# EAGLE design PET_snes_gamepad (EAGLE 9.6.0)
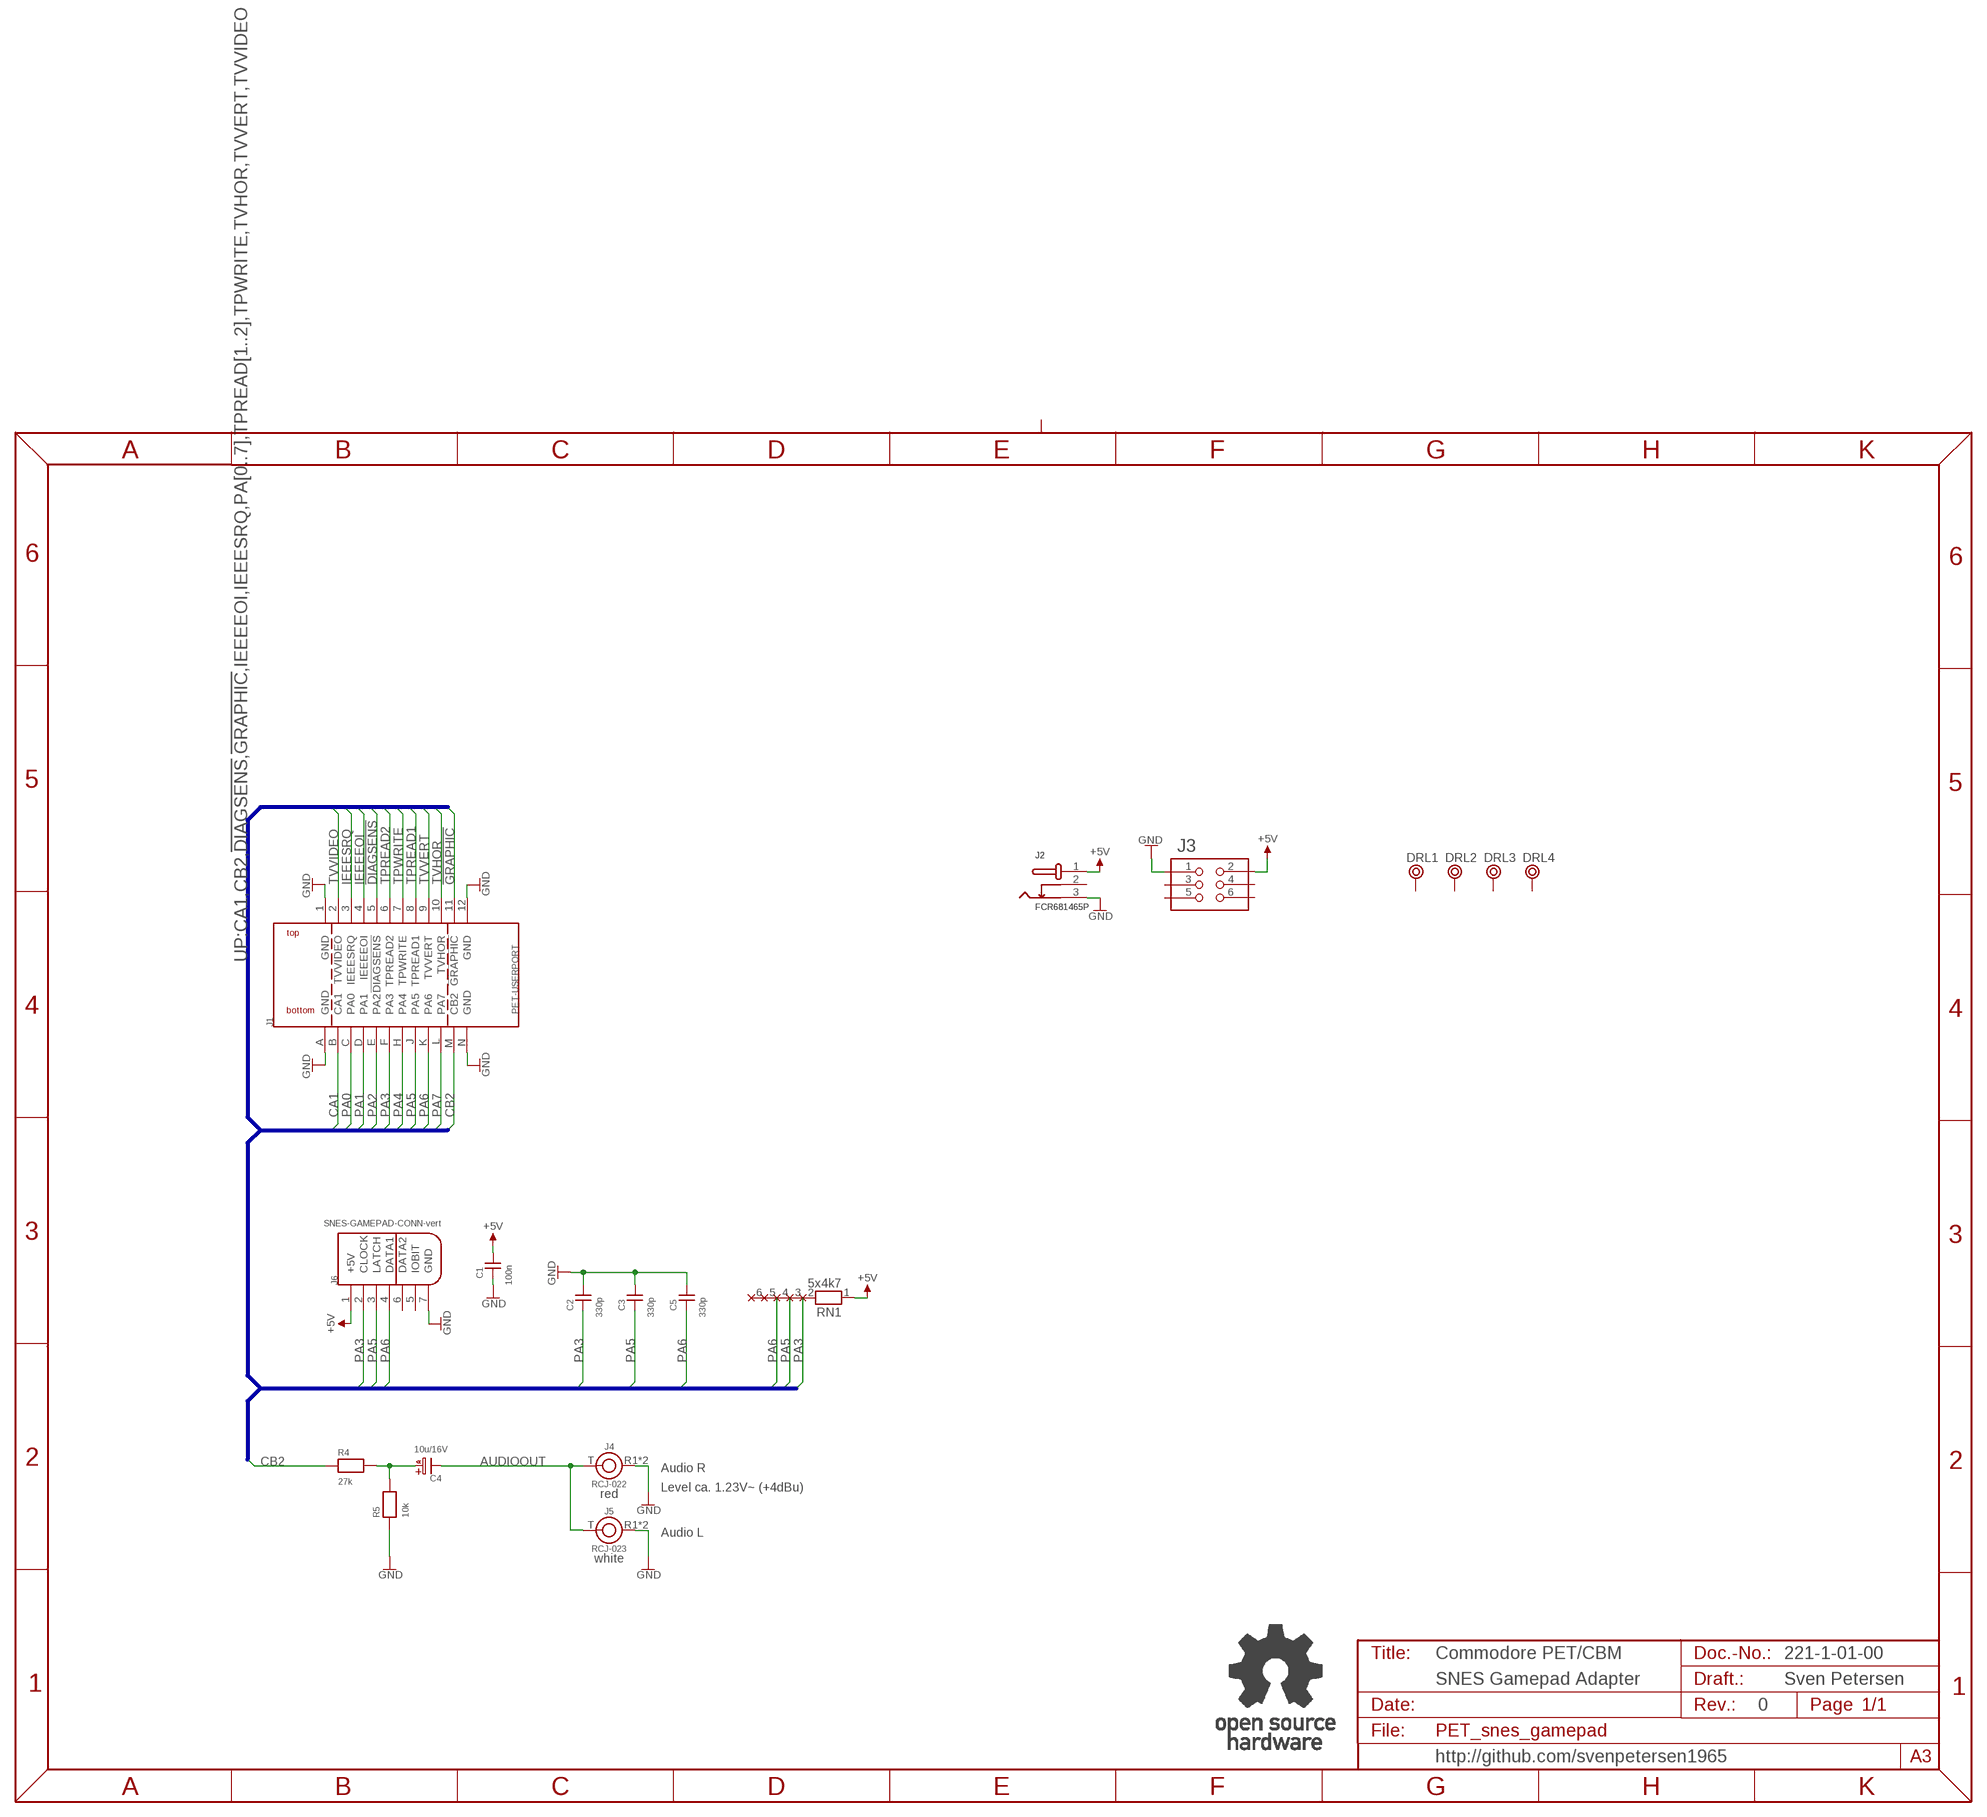
[diagram p0: schematic, sheet 1]

## Parts
C1  100n  CAP01  [C-2,5]
C2  330p  CAP01  [C-2,5]
C3  330p  CAP01  [C-2,5]
C4  10u/16V  C05,0/2,0  [C5,0/2,0]
C5  330p  CAP01  [C-2,5]
DRL1  BOHR3,5  [BOHR3,5]
DRL2  BOHR3,5  [BOHR3,5]
DRL3  BOHR3,5  [BOHR3,5]
DRL4  BOHR3,5  [BOHR3,5]
J1  PET-USERPORT  [USERPORT]
J2  FCR681465P  [FCR681465P]
J3  2X03WV  [2X03WV]
J4  RCJ-022  RCJ-02X  [RCJ-02X]
J5  RCJ-023  RCJ-02X  [RCJ-02X]
J6  SNES-GAMEPAD-CONN-vert  GAMEPAD-CONN_SNESCONN  [SNES_GAMEPAD_VERT]
R4  27k  RES04  [R-10]
R5  10k  RES04  [R-10]
RN1  5x4k7  RN05  [RN-6]
U$2  OPEN_SOURCE_HW  [OPENHW]

## Nets
!DIAGSENS: J1.5(!DIAGSENS)
!GRAPHIC: J1.11(!GRAPHIC)
+5V: C1.2 J2.1 J3.2 J6.1(+5V) RN1.1
AUDIOOUT: C4.K(-) J4.T J5.T
CA1: J1.B(CA1)
CB2: J1.M(CB2) R4.1
GND: C1.1 C2.2 C3.2 C5.2 J1.1(GND) J1.12(GND) J1.A(GND) J1.N(GND) J2.3 J3.1 J4.R1(R) J4.R2(R) J5.R1(R) J5.R2(R) J6.7(GND) R5.1
IEEEEOI: J1.4(IEEEEOI)
IEEESRQ: J1.3(IEEESRQ)
N$1: C4.A(+) R4.2 R5.2
PA0: J1.C(PA0)
PA1: J1.D(PA1)
PA2: J1.E(PA2)
PA3: C2.1 J1.F(PA3) J6.2(CLOCK) RN1.2
PA4: J1.H(PA4)
PA5: C3.1 J1.J(PA5) J6.3(LATCH) RN1.3
PA6: C5.1 J1.K(PA6) J6.4(DATA1) RN1.4
PA7: J1.L(PA7)
TPREAD1: J1.8(TPREAD1)
TPREAD2: J1.6(TPREAD2)
TPWRITE: J1.7(TPWRITE)
TVHOR: J1.10(TVHOR)
TVVERT: J1.9(TVVERT)
TVVIDEO: J1.2(TVVIDEO)
Unconnected: DRL1.P$1 DRL2.P$1 DRL3.P$1 DRL4.P$1 J2.2 J3.3 J3.4 J3.5 J3.6 J6.5(IOBIT) J6.6(DATA2) RN1.5 RN1.6

## Buses
UP:CA1,CB2,!DIAGSENS,!GRAPHIC,IEEEEOI,IEEESRQ,PA[0..7],TPREAD[1..2],TPWRITE,TVHOR,TVVERT,TVVIDEO

## Notes on the sheet
- Audio R
- Level ca. 1.23V~ (+4dBu)
- red
- Audio L
- white
- Commodore PET/CBM | 221-1-01-00
- SNES Gamepad Adapter | Sven Petersen
- 0
- http://github.com/svenpetersen1965

## Library data of the parts
C1-C3 C5 = DISCRETE:CAP01
C4 = ELCO:C05,0/2,0
DRL1-DRL4 = Mech_Bohr:BOHR3,5
J1 = Commodore:PET-USERPORT
J2 = Cliff:FCR681465P
J3 = PINHEAD:2X03WV
J4 J5 = CUI_INC:RCJ-02X
J6 = snes_gamepad:GAMEPAD-CONN_SNESCONN
R4 R5 = DISCRETE:RES04
RN1 = DISCRETE:RN05
U$2 = Logo:OPEN_SOURCE_HW

## Board
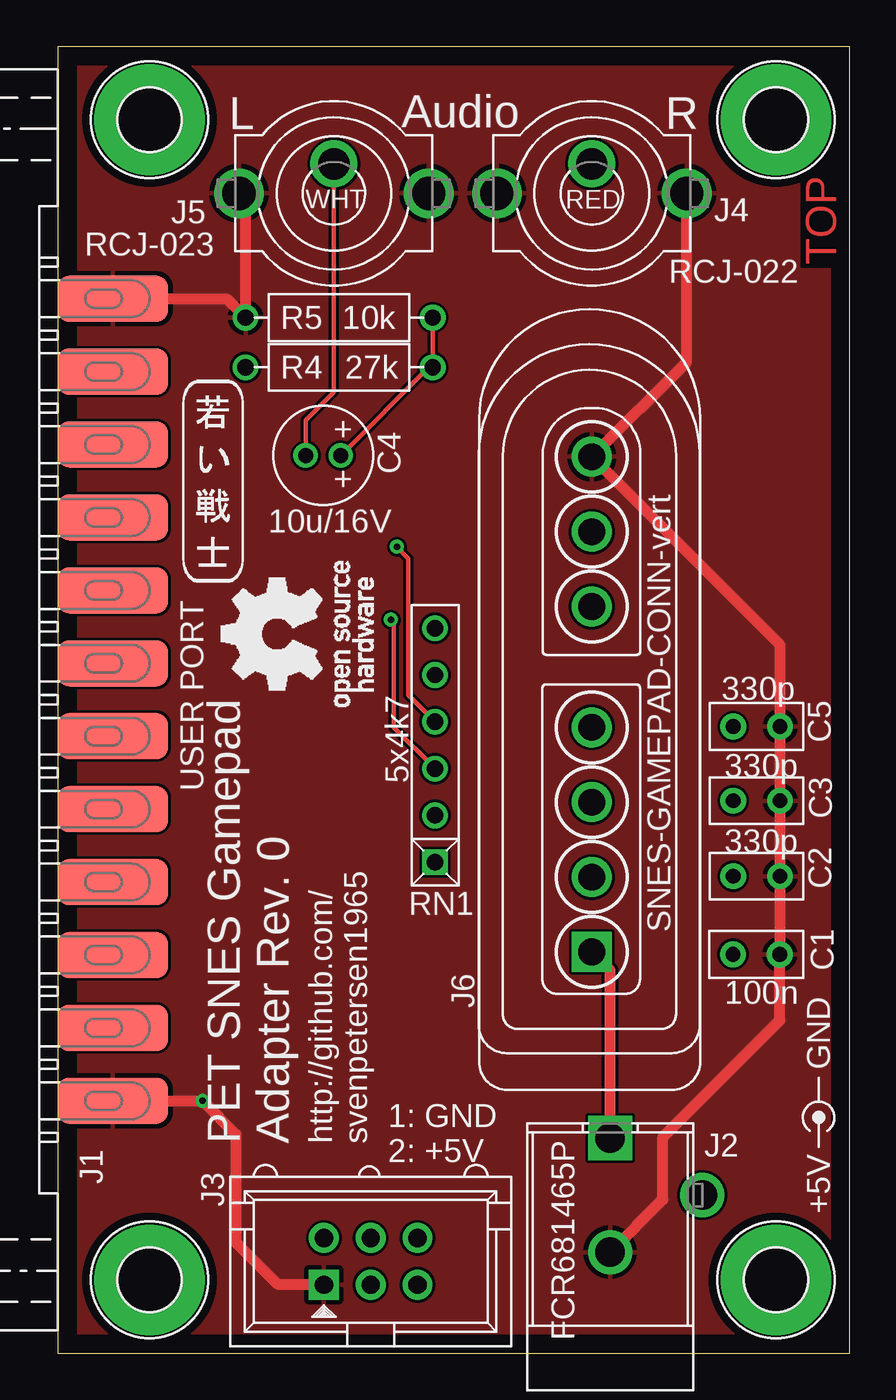
[diagram p1: board, top side]
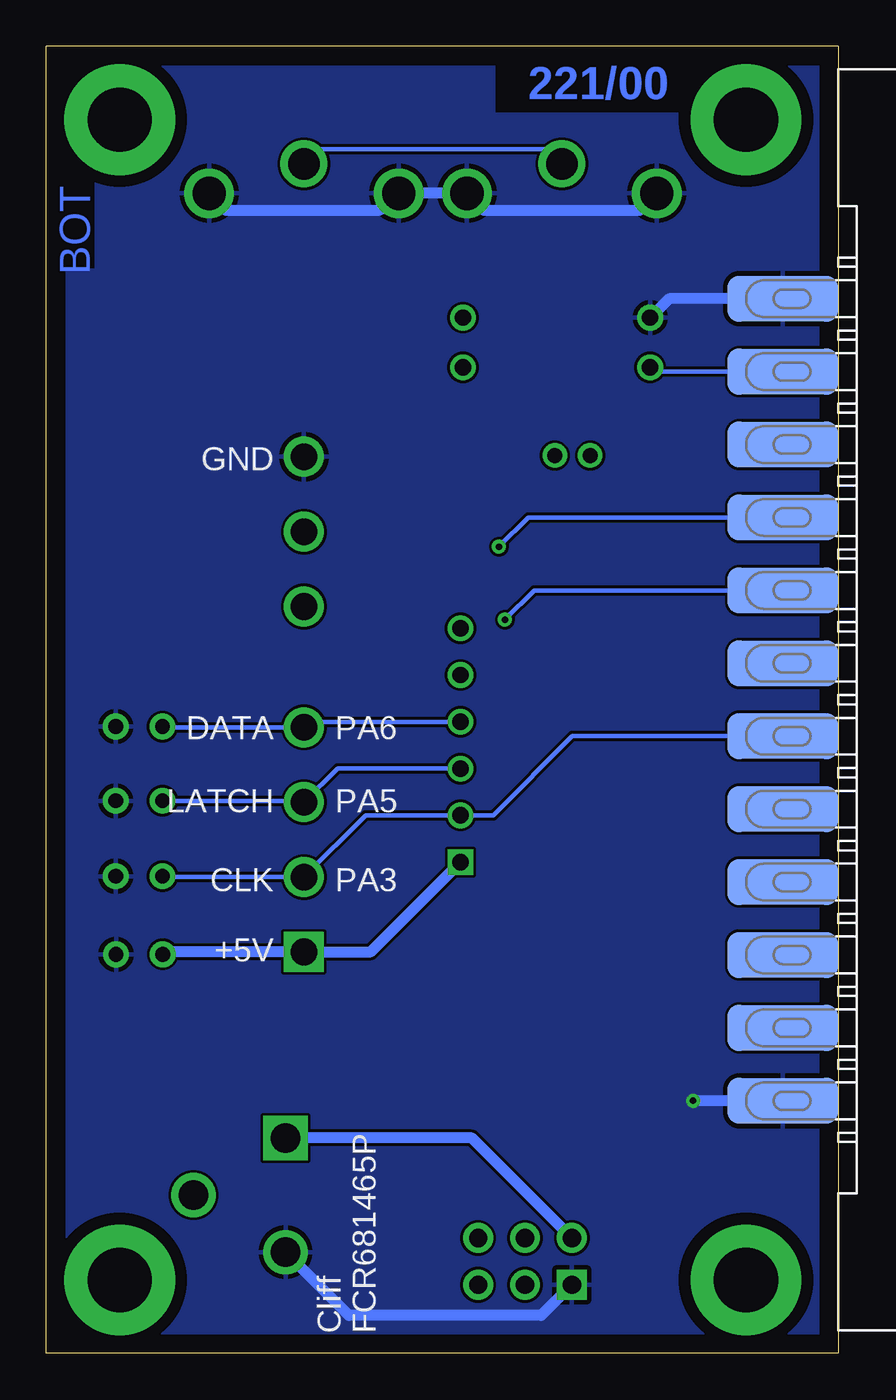
[diagram p2: board, bottom side, seen from below]

Size 43 x 71 mm. Coordinates in mm from the lower left corner, seen from the top.
Outline: 0,0 43,0 43,71 0,71 0,0
Copper layers (1*16): Top 0.035mm / dielectric 1.5mm / Bottom 0.035mm
Design rules "default *": minimum track width 6mil, minimum drill 0.35mm, track to track 6mil, track to pad 6mil, pad to pad 6mil, via to via 6mil, smd to smd 6mil, copper to edge 40mil, drill to drill 6mil, minimum pad ring 10mil, minimum via ring 8mil, stop-mask expansion 4mil, vias tented up to drill 25mil, thermal gap 10mil
bRestrict: 2 lines

### Footprints (pad centres in the part's own frame; a part is rotated, then mirrored left to right if it is on the bottom)
C-2,5 = drill 0.8 pad 1.397: 1 -1.27,0; 2 1.27,0
C5,0/2,0 = drill 0.813 pad 1.27: A -0.953,0; K 0.953,0
BOHR3,5 = drill 3.5 pad 6: P$1 0,0
USERPORT = smd 2.5 x 6: 1 -21.78,-3; 2 -17.82,-3; 3 -13.86,-3; 4 -9.9,-3; 5 -5.94,-3; 6 -1.98,-3; 7 1.98,-3; 8 5.94,-3; 9 9.9,-3; 10 13.86,-3; 11 17.82,-3; 12 21.78,-3 | smd 2.5 x 6 bottom: A -21.78,-3; B -17.82,-3; C -13.86,-3; D -9.9,-3; E -5.94,-3; F -1.98,-3; H 1.98,-3; J 5.94,-3; K 9.9,-3; L 13.86,-3; M 17.82,-3; N 21.78,-3
FCR681465P = drill 1.6 square: 1 0,13.7 | drill 1.6: 2 5,10.6; 3 0,7.5
2X03WV = drill 1 pad 1.626 square: 1 -2.54,-1.27 | drill 1 pad 1.626: 2 -2.54,1.27; 3 0,-1.27; 4 0,1.27; 5 2.54,-1.27; 6 2.54,1.27
RCJ-02X = drill 1.8 pad 2.54: R1 -5.15,0; R2 5.15,0 | drill 1.7 pad 2.5: T 0,1.6
SNES_GAMEPAD_VERT = drill 1.448 square: 1 -12.192,0 | drill 1.448: 2 -8.128,0; 3 -4.064,0; 4 0,0; 5 6.564,0; 6 10.628,0; 7 14.692,0
R-10 = drill 0.889 pad 1.397: 1 -5.08,0; 2 5.08,0
RN-6 = drill 0.889 pad 1.397 square: 1 -6.35,0 | drill 0.889 pad 1.397: 2 -3.81,0; 3 -1.27,0; 4 1.27,0; 5 3.81,0; 6 6.35,0

### Placement (x,y rotation side)
C1  37.93,21.68 180 top
C2  37.95,25.92 0 top
C3  37.95,30.01 0 top
C4  14.42,48.77 180 top
C5  37.95,34.04 0 top
DRL1  5,4 0 top
DRL2  39,4 0 top
DRL3  39,67 0 top
DRL4  5,67 0 top
J1  0,35.5 90 top
J2  30,-2 0 top
J3  17,5 0 top
J4  29,63 0 top
J5  15,63 0 top
J6  29,34 90 top
R4  15.29,53.55 0 top
R5  15.29,56.25 0 top
RN1  20.5,33.03 90 top
U$2  17.14,35.13 90 top
U$11  [2LAYER]  42.28,59.13 90 top
U$22  [PCB-TITLE/]  -0.08,92.44 0 top  (outside the outline)
U$26  [SVEN_TAG]  8.48,47.49 0 top

### Tracks (layer width: path | path; a pad name or v marks a point on that pad's centre or on a via)
+5V
  Top 0.61: J2.1 30,20.81 J6.1
  Bottom 0.61: J3.2 19.89,11.7 J2.1 | RN1.1 25.37,21.81 J6.1 36.53,21.81 C1.2
AUDIOOUT
  Top 0.254: J5.T 15,52.21 13.47,50.67 C4.K
  Bottom 0.254: J5.T 15.8,65.41 28.2,65.41 J4.T
CB2
  Bottom 0.254: J1.M 9.97,53.32 R4.1
GND  (via drill 0.35)
  Top 0.61: J1.N 9.18,57.28 R5.1 10.21,62.65 J5.R1 | J4.R2 34.15,53.84 J6.7 39.22,38.47 C5.2 C3.2 C2.2 39.22,21.7 C1.1 39.21,21.66 39.21,18.1 32.86,11.75 32.86,8.36 J2.3 | J3.1 11.99,3.73 9.68,6.03 9.68,11.91 v7.87,13.72 J1.A
  Bottom 0.61: J1.N 9.18,57.28 R5.1 | J5.R1 10.78,62.07 19.22,62.07 J5.R2 J4.R1 24,63 24.92,62.07 33.22,62.07 J4.R2 | J1.A v7.87,13.72 | v7.87,13.72 7.94,13.65 v7.87,13.72 | J3.1 16.13,2.06 26.56,2.06 J2.3
  pour Top: 0.79,70.26 42.47,70.26 42.47,0.64 0.79,0.64
  pour Bottom: 0.79,70.26 42.47,70.26 42.47,0.64 0.79,0.64
N$1
  Top 0.254: C4.A 20.16,53.55 R4.2 R5.2
PA3
  Bottom 0.254: C2.1 36.64,25.87 J6.2 25.65,29.22 RN1.2 20.48,29.21 18.73,29.21 14.42,33.52 J1.F
PA5  (via drill 0.35)
  Top 0.254: v18.1,39.85 18.26,39.69 18.26,34 RN1.3
  Bottom 0.254: RN1.3 27.18,31.76 J6.3 29.08,30.01 C3.1 | J1.J 16.5,41.44 v18.1,39.85
PA6  (via drill 0.35)
  Top 0.254: v18.41,43.81 19.05,43.18 19.05,35.75 RN1.4
  Bottom 0.254: RN1.4 28.7,34.3 J6.4 36.64,34 C5.1 | J1.K 16.83,45.4 v18.41,43.81

### Text on the board
Bottom: 221/00
tPlace: GND | PET SNES Gamepad / Adapter Rev. 0 | http://github.com/ / svenpetersen1965 | +5V | 1: GND / 2: +5V
tNames: Audio | L | R | WHT | RED | USER PORT
bNames: GND | PA6 | DATA | PA5 | LATCH | PA3 | CLK | +5V | Cliff / FCR681465P
Measures: 1
Document: 221-2-01-00 | Sven Petersen / 2025 | 35µm | 2 | 0